# Altium schematic sheet Pretty Fly ngl 2.0.SchDoc
size A3; SheetNumber: 1; SheetTotal: 1
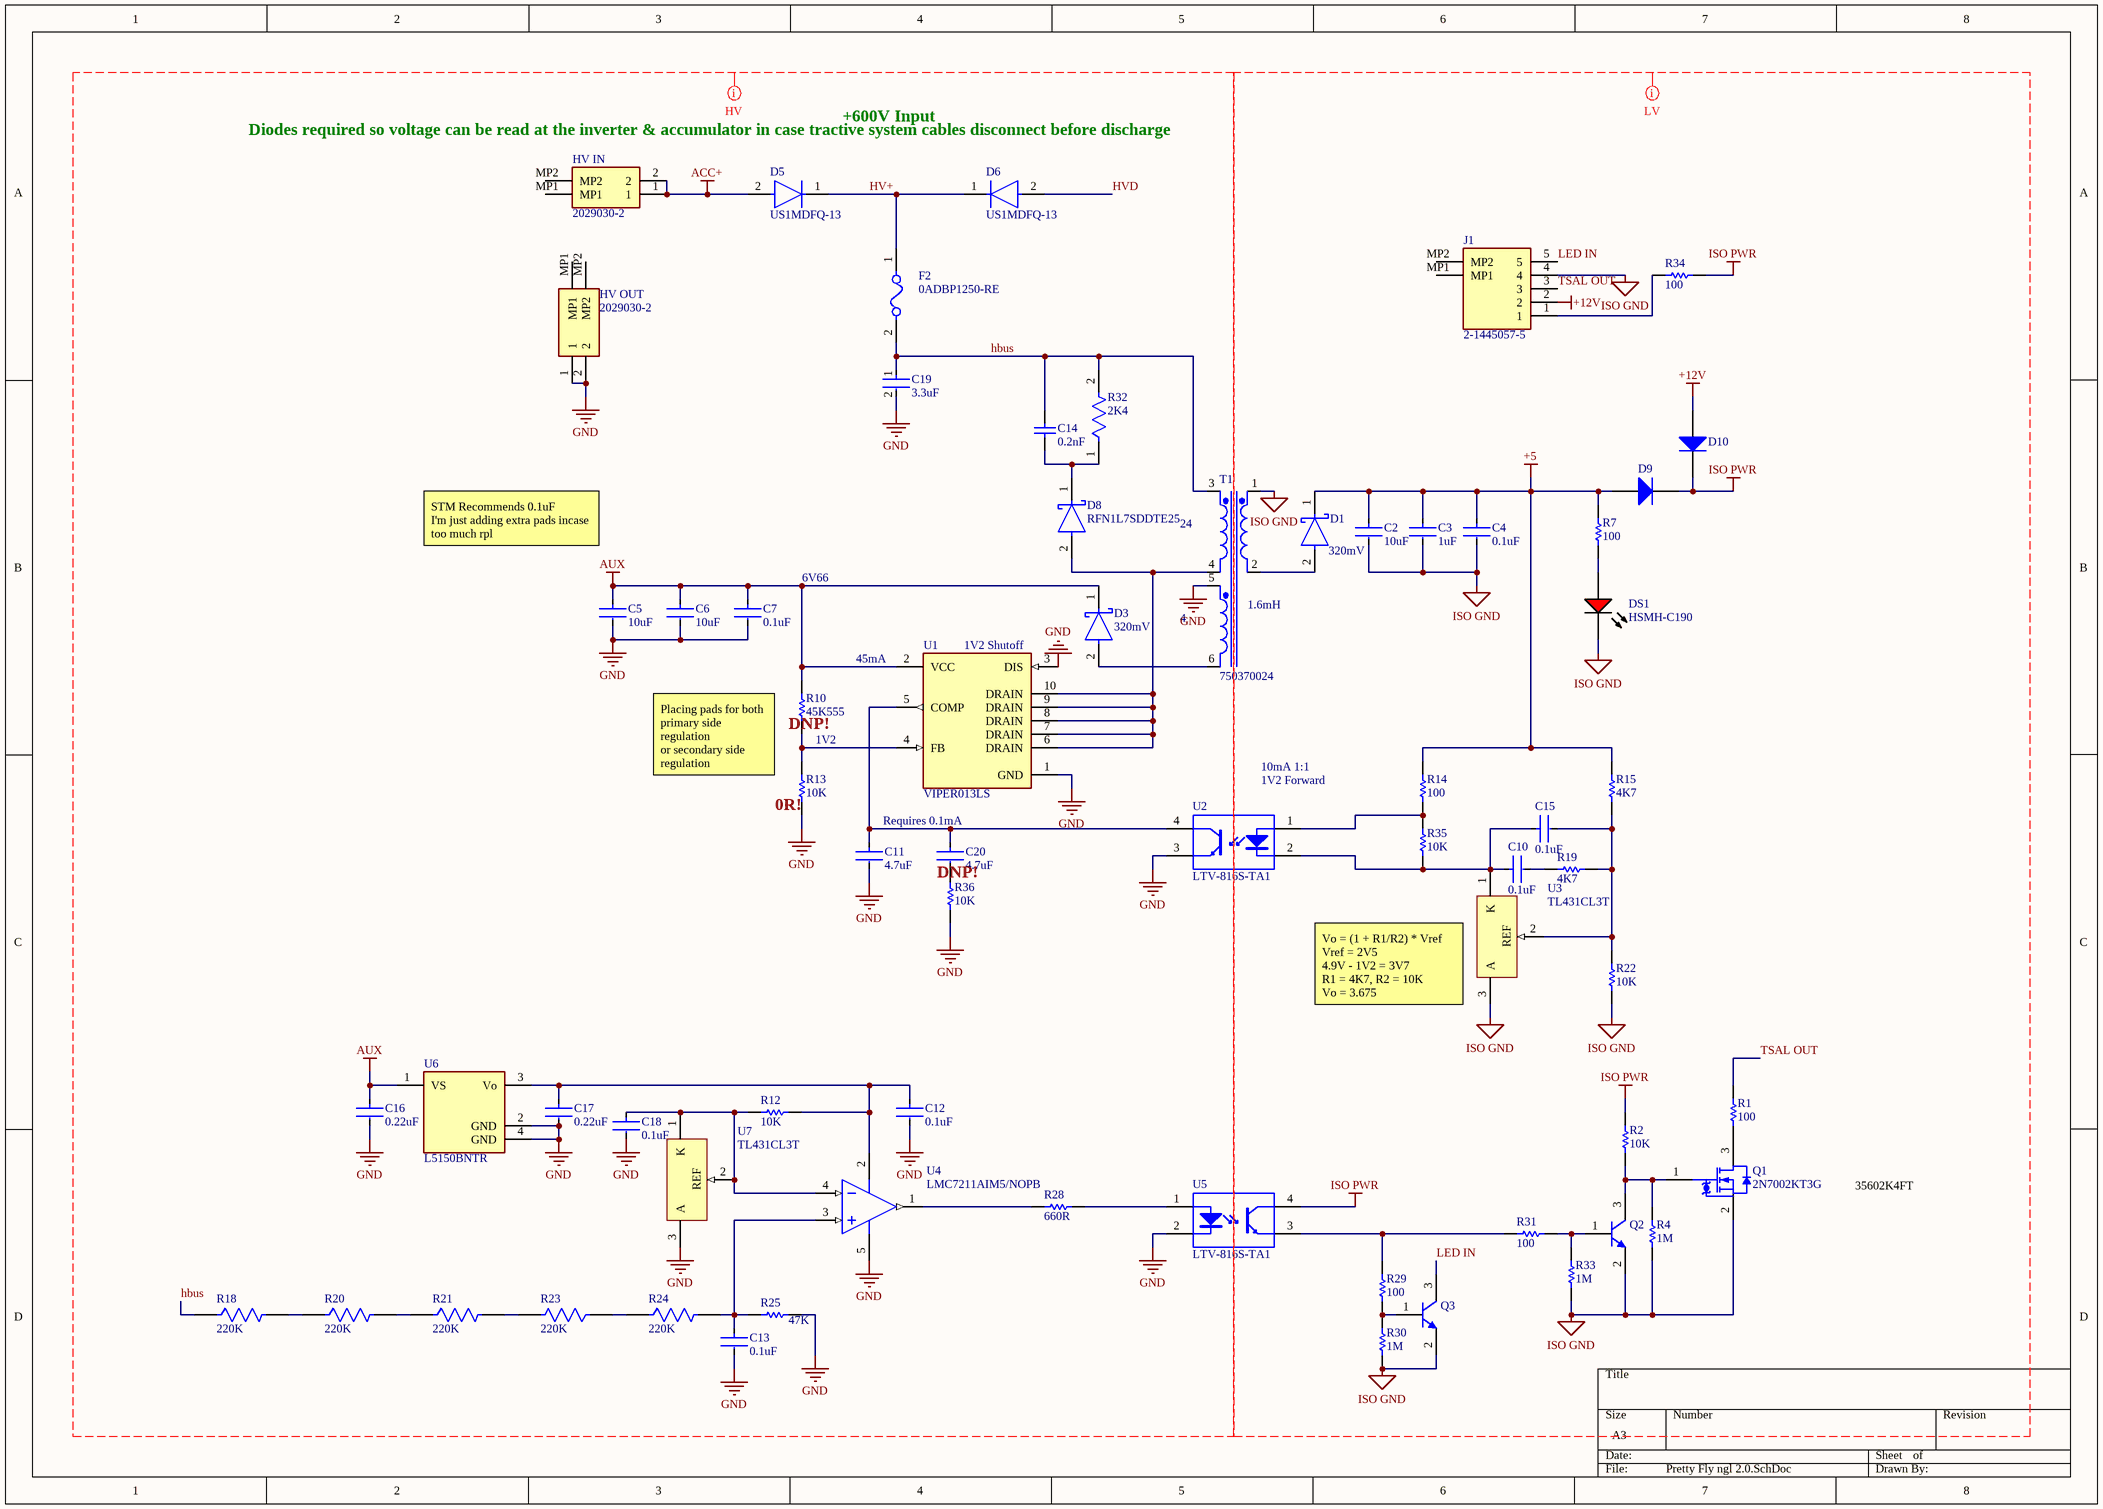
[diagram p0: Pretty Fly ngl 2.0.SchDoc]

## Parts
C2  10uF  [FP-C2012-125-0_2-IPC_B]
C3  1uF  [FP-C2012-125-0_2-IPC_B]
C4  0.1uF  [FP-C2012-125-0_2-IPC_B]
C5  10uF  [FP-C2012-125-0_2-IPC_B]
C6  10uF  [FP-C2012-125-0_2-IPC_B]
C7  0.1uF  [FP-C2012-125-0_2-IPC_B]
C10  0.1uF  [FP-C2012-125-0_2-IPC_B]
C11  4.7uF  [FP-C2012-125-0_2-IPC_B]
C12  0.1uF  [FP-C2012-125-0_2-IPC_B]
C13  0.1uF  [FP-C2012-125-0_2-IPC_B]
C14  0.2nF  [KEMT-1206-2_M]
C15  0.1uF  [FP-C2012-125-0_2-IPC_B]
C16  0.22uF  [FP-C2012-125-0_2-IPC_B]
C17  0.22uF  [FP-C2012-125-0_2-IPC_B]
C18  0.1uF  [FP-C2012-125-0_2-IPC_B]
C19  3.3uF  [FP-ECW-FG1B205JA-MFG]
C20  4.7uF  [FP-C2012-125-0_2-IPC_B]
D1  320mV  [FP-SOD128-MFG]
D3  320mV  [FP-SOD128-MFG]
D5  US1MDFQ-13  [FP-D-FLAT-MFG]
D6  US1MDFQ-13  [FP-D-FLAT-MFG]
D8  RFN1L7SDDTE25  [FP-PMDS-MFG]
D9  PMEG4010EGWX  [SOD-123]  (value not drawn)
D10  PMEG4010EGWX  [SOD-123]  (value not drawn)
DS1  HSMH-C190  [AVAG-HSMX-C190_V]
F2  0ADBP1250-RE  [FP-0ADBP-MFG]
HV_IN  2029030-2  [20290302]
HV_OUT  2029030-2  [20290302]
J1  2-1445057-5  [214450575]
Q1  2N7002KT3G  [ONSC-SOT-23-3-318-08_V]
Q2  MMBTA42LT1G  [ONSC-SOT-23-3-318-08_V]  (value not drawn)
Q3  MMBTA42LT1G  [ONSC-SOT-23-3-318-08_V]  (value not drawn)
R1  100  [RESC1608X55X25ML10T15]
R2  10K  [RESC1608X55X25ML10T15]
R4  1M  [RESC1608X55X25ML10T15]
R7  100  [RESC1608X55X25ML10T15]
R10  45K555  [RESC1608X55X25ML10T15]
R12  10K  [RESC1608X55X25ML10T15]
R13  10K  [RESC1608X55X25ML10T15]
R14  100  [RESC1608X55X25ML10T15]
R15  4K7  [RESC1608X55X25ML10T15]
R18  220K  [FP-CRCW1206-e3-MFG]
R19  4K7  [RESC1608X55X25ML10T15]
R20  220K  [FP-CRCW1206-e3-MFG]
R21  220K  [FP-CRCW1206-e3-MFG]
R22  10K  [RESC1608X55X25ML10T15]
R23  220K  [FP-CRCW1206-e3-MFG]
R24  220K  [FP-CRCW1206-e3-MFG]
R25  47K  [RESC1608X55X25ML10T15]
R28  660R  [RESC1608X55X25ML10T15]
R29  100  [RESC1608X55X25ML10T15]
R30  1M  [RESC1608X55X25ML10T15]
R31  100  [RESC1608X55X25ML10T15]
R32  2K4  [FP-WSR-MFG]
R33  1M  [RESC1608X55X25ML10T15]
R34  100  [RESC1608X55X25ML10T15]
R35  10K  [RESC1608X55X25ML10T15]
R36  10K  [RESC1608X55X25ML10T15]
T1  750370024  [Transformer Viper]
U1  VIPER013LS  [FP-SSOP10-8140761-MFG]
U2  LTV-816S-TA1  [LTST-LTV-816S_V]
U3  TL431CL3T  [SOT23-3_L]
U4  LMC7211AIM5/NOPB  [DBV0005A_M]
U5  LTV-816S-TA1  [LTST-LTV-816S_V]
U6  L5150BNTR  [FP-SOT-223-GAPGPS01378-MFG]
U7  TL431CL3T  [SOT23-3_L]

## Nets
+5: C2.1 C3.1 C4.1 D1.1(K) D9.1(A) R7.2 R14.2 R15.2
+12V: D10.1(A) J1.2
ACC+: D5.2(A) HV_IN.1 HV_IN.2
AUX: C5.1 C6.1 C7.1 C16.1 D3.1(K) R10.2 U1.2(VCC) U6.1(VS)
GND: C5.2 C6.2 C7.2 C11.2 C12.2 C13.2 C16.2 C17.2 C18.2 C19.2 HV_OUT.1 HV_OUT.2 R13.1 R25.1 R36.1 T1.5(Sec2+) U1.1(GND) U1.3(DIS) U2.3(EMITTER) U4.5(V-) U5.2(CATHODE) U6.2(GND) U6.4(GND) U7.3(A)
ISO GND: C2.2 C3.2 C4.2 DS1.2(K) J1.4 Q1.2(S) Q2.2(E) Q3.2(E) R4.1 R22.1 R30.1 R33.1 T1.1(Pri+) U3.3(A)
ISO PWR: D9.2(K) D10.2(K) R2.2 R34.1 U5.4(COLLECTOR)
hbus: C14.2 C19.1 F2.2 R18.1 R32.2 T1.3(Sec1+)
HV+: D5.1(C) D6.1(C) F2.1
HVD: D6.2(A)
LED IN: J1.5 Q3.3(C)
TSAL OUT: J1.3 R1.2
NetC10_1: C10.1 C15.1 R35.1 U2.2(CATHODE) U3.1(K)
NetC10_2: C10.2 R19.1
NetC11_1: C11.1 C20.1 U1.5(COMP) U2.4(COLLECTOR)
NetC12_1: C12.1 C17.1 R12.2 U4.2(V+) U6.3(Vo)
NetC13_1: C13.1 R24.2 R25.2 U4.3(IN+)
NetC14_1: C14.1 D8.1(C) R32.1
NetC15_2: C15.2 R15.1 R19.2 R22.2 U3.2(REF)
NetC18_1: C18.1 R12.1 U4.4(IN-) U7.1(K) U7.2(REF)
NetC20_2: C20.2 R36.2
NetD1_2: D1.2(A) T1.2(Pri-)
NetD3_2: D3.2(A) T1.6(Sec2-)
NetD8_2: D8.2(A) T1.4(Sec1-) U1.6(DRAIN) U1.7(DRAIN) U1.8(DRAIN) U1.9(DRAIN) U1.10(DRAIN)
NetDS1_1: DS1.1(A) R7.1
NetJ1_1: J1.1 R34.2
NetQ1_1: Q1.1(G) Q2.3(C) R2.1 R4.2
NetQ1_3: Q1.3(D) R1.1
NetQ2_1: Q2.1(B) R31.1 R33.2
NetQ3_1: Q3.1(B) R29.1 R30.2
NetR10_1: R10.1 R13.2 U1.4(FB)
NetR14_1: R14.1 R35.2 U2.1(ANODE)
NetR18_2: R18.2 R20.1
NetR20_2: R20.2 R21.1
NetR21_2: R21.2 R23.2
NetR23_1: R23.1 R24.1
NetR28_1: R28.1 U5.1(ANODE)
NetR28_2: R28.2 U4.1(OUT)
NetR29_2: R29.2 R31.2 U5.3(EMITTER)

Not connected (* = marked no-connect by the designer): HV_IN MP1 MP2; HV_OUT MP1 MP2; J1 MP1 MP2

## Layout directives
mark named HV: ACC+, AUX, GND, hbus, HV+, HVD
mark named LV: +5, +12V, ISO GND, ISO PWR, LED IN, TSAL OUT

## Notes on the sheet
- Diodes required so voltage can be read at the inverter & accumulator in case tractive system cables disconnect before discharge
- +600V Input
- STM Recommends 0.1uF
  I'm just adding extra pads incase too much rpl
- 6V66
- (near T1) 24
- (near U1) 1V2 Shutoff
- (near T1) 4
- (near T1) 1.6mH
- 45mA
- Placing pads for both
  primary side regulation
  or secondary side regulation
- (near R10) DNP!
- 1V2
- (near U2) 1V2 Forward
- 10mA 1:1
- (near R13) 0R!
- Requires 0.1mA
- DNP!
- (near U3) Vo = (1 + R1/R2) * Vref
  Vref = 2V5
  4.9V - 1V2 = 3V7
  R1 = 4K7, R2 = 10K
  Vo = 3.675
- 35602K4FT

## Library data of the parts
C2-C7 C10 C12 C13 C15-C18 = CMP-08246-000007-2: Multilayer Ceramic Capacitors 4.7μF ±10% 50V X5R SMD 0805; Capacitance: 4.7uF; Case Code (Metric): 2012; Weight: 0.000194oz; Voltage Rating: 50V; Voltage: 50V; Construction: Flat; Series: C; Packaging: Tape and Reel; Height: 1.25mm; Depth: 1.25mm; Resistor Type: Ceramic; Width: 0.049inch; Length: 2mm; Thickness: 0.057inch; REACH SVHC: No SVHC; Max Operating Temperature: 85°C; Case/Package: 0805; Dielectric: X5R; Tolerance: 10%; Dielectric Material: Ceramic; Package Quantity: 1; Mount: Surface Mount; Radiation Hardening: No; Voltage Rating (DC): 50V; Case Code (Imperial): 0805; Termination: SMD/SMT; Min Operating Temperature: -55°C; Lead Free: Lead Free
C11 C20 = CMP-08246-000007-2: Multilayer Ceramic Capacitors 4.7μF ±10% 50V X5R SMD 0805; Case Code (Metric): 2012; Weight: 0.000194oz; Voltage Rating: 50V; Voltage: 50V; Construction: Flat; Series: C; Packaging: Tape and Reel; Height: 1.25mm; Depth: 1.25mm; Resistor Type: Ceramic; Width: 0.049inch; Length: 2mm; Thickness: 0.057inch; REACH SVHC: No SVHC; Max Operating Temperature: 85°C; Case/Package: 0805; Capacitance: 4.7uF; Dielectric: X5R; Tolerance: 10%; Dielectric Material: Ceramic; Package Quantity: 1; Mount: Surface Mount; Radiation Hardening: No; Voltage Rating (DC): 50V; Case Code (Imperial): 0805; Termination: SMD/SMT; Min Operating Temperature: -55°C; Lead Free: Lead Free
C14 = CMP-1037-04202-2: C3216C0G2J221J060AA; Manufacturer: Kemet; Voltage Rating: 50V; Capacitance: 0.1µF; Product Range: KEMET-CSeries; SVHC: ToBeAdvised; Capacitance Tolerance: ±10%; Dielectric Characteristic: X7R; Capacitor Case Style: 1206[3216Metric]; Package Reference: 1206-2; Package Description: 2-Leads SMD, Body 3.2 x 1.6 mm; Packaging: Tape&Reel; Operating Temperature Max: 125degC; Datasheet URL: https://datasheet.ciiva.com/6125/1725438-6125494.pdf; Manufacturer URL: http://www.kemet.com/; Operating Temperature Min: -55degC; Datasheet Version: Jul-13
C19 = CMP-05434-000001-1: ECW-FG80335J; Manufacturer: Panasonic; Manufacturer Part Number: ECW-FG1B205JA; Material: Metallized Polypropylene; Value: 2uF; Automotive Grade: Grade 2; Voltage Rating: 1100V; Tolerance: 5%; Category: Cap; Octopart: https://octopart.com/ecwfg1b205ja-panasonic-104895355; Digikey Description: CAP FILM 2UF 5% 1.1KVDC RADIAL; Height: 25mm; Temperature Range High: +110°C; Device Class L2: Capacitors; Temperature: -40°C to +110°C; Package: 0; Lead Free: Yes; Temperature Range Low: -40°C; Automotive: Yes; Device Class L3: Film Capacitors; RoHS: TRUE; ComponentLink2URL: https://industrial.panasonic.com/cdbs/www-data/pdf/RDL0000/RDL0000C245.pdf; Device Class L1: Passive Components; Capacitance: 2uF; ComponentLink2Description: Datasheet
D1 D3 = CMP-14398-000034-1: PMEG6030EVPX; RoHS Compliant: Yes
D5 D6 = CMP-12791-000003-1: DIODE GEN PURP 1KV 1A DFLAT; Manufacturer: Diodes; Max Repetitive Reverse Voltage: 1000V; Max Surge Forward Current: 30A; Capacitance: 10pF; Peak Reverse Current: 5uA; Max Junction Temp: +150°C; Automotive Grade: Grade 0; Value: 10pF; Digikey Description: DIODE GEN PURP 1KV 1A DFLAT; Octopart: https://octopart.com/us1mdfq-13-diodes+inc.-75381839; Temperature Range High: +150°C; ComponentLink2Description: Datasheet; Category: Diode; Automotive: Yes; Temperature: -55°C to +150°C; ComponentLink2URL: https://www.diodes.com/assets/Datasheets/US1JDFQ_US1MDFQ.pdf; Package: D-FLAT; Manufacturer Part Number: US1MDFQ-13; Reverse Voltage: 1000V; Device Class L3: Rectifier Diodes; Forward Current: 1A; Height: 1.1mm; Footprint Url: https://www.diodes.com/assets/Package-Files/D-FLAT.pdf; Device Class L2: Diodes; Lead Free: Yes; Device Class L1: Discrete Semiconductors; Temperature Range Low: -55°C; RoHS: TRUE
D8 = CMP-08971-000006-1: Rectifiers DIODE GEN PURPOSE / 45ns / 1.15V; Manufacturer: Rohm; Obsolete Part: true; Manufacturer Part Number: RSX501L-20TE25; Max Repetitive Reverse Voltage: 25V; Max Surge Forward Current: 70A; Peak Reverse Current: 500uA; Forward Current: 5A; Max Junction Temp: +125°C; Reverse Voltage: 20V; Temperature Range High: +125°C; Digikey Description: DIODE SCHOTTKY 20V 5A PMDS; Automotive: No; Height: 2.2mm; Category: Diode; Device Class L3: Schottky Diodes; Octopart: https://octopart.com/rsx501l-20te25-rohm-333183; Temperature: to +125°C; RoHS: TRUE; ComponentLink2URL: https://eu.mouser.com/datasheet/2/348/rsx501l-20te25-e-1139044.pdf; Device Class L2: Diodes; Package: PMDS; Lead Free: Yes; Device Class L1: Discrete Semiconductors; ComponentLink2Description: Datasheet
D9 D10 = 1N4448: 153-0632; Published: 8-Jun-2000; LatestRevisionDate: 17-Jul-2002; LatestRevisionNote: Re-released for DXP Platform.; DatasheetDocument: 1997; PackageReference: DO-35; Publisher: Altium Limited; Code_JEDEC: DO-204-AH; ComponentLink1Description: Manufacturer Link; ComponentLink1URL: http://www.fairchildsemi.com/; ComponentLink2Description: Datasheet; ComponentLink2URL: http://www.fairchildsemi.com/ds/1N%2F1N4448.pdf
DS1 = CMP-1744-00004-1: LED Uni-Color Red, 65 mW, 20 mA, -40 to 85 degC, 2-Pin SMD, RoHS, Tape and Reel; Connector Type: USB; Gender: Male; Current Rating: 1 A; Length: 7.5 mm; Lead Pitch: 0.65 mm; PackageReference: HSMX-C190; Package Quantity: 2000; Max Operating Temperature: 85 degC; PackageDescription: 2-Pin Surface Mount Device, Body 1.6 x 0.8 mm, Height 0.9 mm; ComponentLink3Description: Package Specification; Mount: Surface Mount; Min Operating Temperature: -30 degC; ComponentLink3URL: http://www.fairchildsemi.com/dwg/MA/MA03D.pdf; ComponentLink1Description: Manufacturer URL; Contact Material: Copper; Pins: 5; Width: 5.6 mm; ComponentLink2Description: Datasheet; RoHSCompliant: true; DatasheetVersion: Mar-12; Height: 2.8 mm; Packaging: Tape and Reel; Contact Plating: Gold; ComponentLink1URL: http://www.avagotech.com/; REACH SVHC: No SVHC; ComponentLink2URL: http://docs.avagotech.com/docs/AV02-0551EN
F2 = CMP-16042-000001-1: FUSE CERM 1.25A 1000V AXL; Manufacturer: Bel Fuse; Fuse I2T: 3A2Sec; Fuse Voltage Drop: 550mV; Fuse Blow Speed: Fast; Resistance: 300mΩ; Value: 300mΩ; Ipc Land Pattern Name: CAPAD3723W100L3361D676; Lead Free: Yes; Max Fuse Dc Voltage: 1000V; Device Class L1: Circuit Protection; Manufacturer Part Number: 0ADBP1250-RE; Height: 6.76mm; Package: 0ADBP; Fuse Current: 1.25A; Octopart: https://octopart.com/0adbp1250-re-bel+fuse-88207834; Temperature Range High: +105°C; Device Class L3: unset; Device Class L2: Fuses; Category: Fuse; ComponentLink2URL: https://belfuse.com/resources/datasheets/circuitprotection/ds-cp-0adbx-series.pdf; Temperature: -50°C to +105°C; Voltage Rating: 1000V; Digikey Description: FUSE CERM 1.25A 1000V AXL; Temperature Range Low: -50°C; Max Fuse Ac Voltage: 1000V; ComponentLink2Description: Datasheet; Automotive: No; RoHS: TRUE
HV_IN HV_OUT = 2029030-2: Connector; Manufacturer_Name: TE Connectivity; Datasheet Link: https://datasheet.datasheetarchive.com/originals/distributors/Datasheets_SAMA/f75355dc101dbac16187fb02437cb13d.pdf; Height: 4.37mm; Manufacturer_Part_Number: 2029030-2
J1 = 2-1445057-5: Connector; Manufacturer_Name: TE Connectivity; Datasheet Link: https://componentsearchengine.com/Datasheets/1/2-1445057-5.pdf; Height: 5.67mm; Manufacturer_Part_Number: 2-1445057-5
Q1 = CMP-1058-00785-1: Small Signal MOSFET, 60 V, 380 mA, Single, N-Channel, 3-Pin SOT-23, Pb-Free, Tape and Reel; Manufacturer: On Semiconductor; Crss Typ (pF): 2.2; Ciss Typ (pF): 24.5; VGS Max (V): 20; ID Max (A): 0.38; VGS(th) Max (V): 2.3; Channel Polarity: N Channel; Coss Typ (pF): 4.2; V(BR)DSS Min (V): 60; Package Type: SOT-23-3; Mounting Technology: Surface Mount; ComponentLink2URL: http://www.onsemi.com/pub_link/Collateral/2N7002K-D.PDF; ComponentLink3Description: Package Specification; DatasheetVersion: Rev. 11; Configuration: Single; PackageReference: SOT-23-3-318-08; Packing: Tape and Reel; ComponentLink2Description: Datasheet; PackageVersion: Rev. AP, 11/2009; RoHS: Pb-Free; ComponentLink1Description: Manufacturer URL; ComponentLink1URL: http://www.onsemi.com/; PackageDescription: 3-Pin Small Outline Transistor, Body 2.92 x 1.3 mm, Pitch 0.95 mm; PartNumber: 2N7002KT3G; ComponentLink3URL: http://www.onsemi.cn/pub_link/Collateral/318-08.PDF
Q2 Q3 = CMP-1048-00662-1: High Voltage Transistor, NPN Silicon, 3-Pin SOT-23, Pb-Free, Tape and Reel; Manufacturer: On Semiconductor; fT Min (MHz): 50; IC Continuous (A): 0.5; ComponentLink1URL: http://www.onsemi.com/; ComponentLink3URL: http://www.onsemi.cn/pub_link/Collateral/318-08.PDF; RoHS: TRUE; ComponentLink2Description: Datasheet; PartNumber: MMBTA42LT1G; Polarity: NPN; DatasheetVersion: Rev. 12; PackageReference: SOT-23-3-318-08; PackageDescription: 3-Pin Small Outline Transistor, Body 2.92 x 1.3 mm, Pitch 0.95 mm; ComponentLink3Description: Package Specification; ComponentLink1Description: Manufacturer URL; Packing: Tape and Reel; PackageVersion: Rev. AP, 11/2009; Mounting Technology: Surface Mount; ComponentLink2URL: http://www.onsemi.cn/pub_link/Collateral/MMBTA42LT1-D.PDF
R1 R2 R4 R7 R10 R12-R15 R19 R22 R25 R28-R31 R33-R36 = CMP-2100-03667-1: Chip Resistor, 0 Ohm, +/- 5%, 0.1 W, -55 to 155 degC, 0603 (1608 Metric), RoHS, Tape and Reel; Manufacturer: Yageo; Temperature Coefficient: 200ppm/degreesC; Voltage Rating: 50V; Power Rating: 100mW; Resistance: 0mOhm; Width: 0.8mm; Max Operating Temperature: 155degC; Tolerance: 5%; Package Reference: 0603; Height: 0.45mm; Depth: 0.8mm; Package Description: 2-Pin Surface Mount Device, Body 1.6 x 0.8 mm; Termination: SMD/SMT; Package Quantity: 5000; Case/Package: 0603; Case Code (Imperial): 0603; Radiation Hardening: No; Number of Pins: 2; Length: 1.6mm; Lead Free: LeadFree; Voltage Rating (DC): 50V; Military Standard: Not; Datasheet URL: http://www.yageo.com/NewPortal/yageodocoutput?fileName=/pdf/R-Chip/PYu-RC_Group_51_RoHS_L_5.pdf; Manufacturer URL: http://www.yageo.com/; Packaging: TapeandReel; Case Code (Metric): 1608; Min Operating Temperature: -55degC; Composition: ThickFilm; RoHSCompliant: true; Contact Plating: Tin; Datasheet Version: Rev. 5, 10/2016; REACH SVHC: NoSVHC
R18 R20 R21 R23 R24 = CMP-02407-001891-1: CRMA1206AF220KDKEF; Voltage Rating (DC): 200V; Power Rating: 250mW; Resistance: 33R; Tolerance: 1%; Temperature Coefficient: 100ppm/°C; Features: Automotive AEC-Q200; Case Code (Imperial): 1206; Packaging: Tape and Reel; Package Quantity: 10; Composition: Thick Film; Height: 0.55mm; Depth: 1.6mm; Radiation Hardening: No; Lead Free: Lead Free; Width: 1.6mm; Weight: 0.000353oz; Case Code (Metric): 3216; Max Power Dissipation: 250mW; Voltage Rating: 200V; Termination: SMD/SMT; Min Operating Temperature: -55°C; Case/Package: 1206; Contact Plating: Tin; Max Operating Temperature: 155°C; Military Standard: Not; Number of Terminations: 2; Length: 3.2mm
R32 = CMP-02407-000027-1: Thick Film Resistors - SMD 3560 2K4 1% / 35602K4FT; Manufacturer Part Number: WSR3R1000FEK; Manufacturer: Vishay; Value: 100mΩ; Temperature Coefficient: 75ppm/°C; Power Rating: 3W; Automotive Grade: Grade 0; Digikey Description: RES 0.1 OHM 1% 3W 4527; Temperature Range High: +275°C; ComponentLink2URL: http://www.vishay.com/docs/30101/wsr.pdf; RoHS: TRUE; Device Class L1: Passive Components; Automotive: Yes; Temperature Range Low: -65°C; Tolerance: 1%; Device Class L3: Chip SMD Resistors; Series: WSR; Temperature: -65°C to +275°C; Resistance: 100mΩ; Device Class L2: Resistors; Octopart: https://octopart.com/wsr3r1000fek-vishay-39709091; Package: WSR; Mouser Description: Res Metal Strip 4527 0.1 Ohm 1% 3W ±75ppm/C Sulfur Resistant Molded J-Lead SMD Automotive Bulk; ComponentLink2Description: Datasheet; Composition: Metal Strip; Category: Res; Lead Free: Yes; Height: 2.537mm
T1 = Trans3: Three-winding Transformer (Non-Ideal); Sim Note: Enter the turns ratios, Core loss resistance, Magnetising Reactance, Leakage Reactances and Resistances referred to the primary side into the parameter fields.; Published: 25-Jan-2001; LatestRevisionDate: 17-Jul-2002; LatestRevisionNote: Re-released for DXP Platform.; PackageReference: TRF_6; Publisher: Altium Limited; PackageDescription: Transformer; 6 Leads
U1 = CMP-12154-000005-1: IC OFFLINE CONV PWM 10SSOP; Manufacturer: STMicroelectronics; Switching Frequency: 60kHz; Max Duty Cycle: 80%; Number Of Outputs: 1; Output Type: Fixed; Max Power Dissipation: 1W; Max Junction Temp: +150°C; Min Supply Voltage: 4.5V; Switching Topology: Buck,Buck-Boost,Flyback; Nominal Supply Current: 0.85mA; Standoff Height: 0.1mm; Max Supply Voltage: 30V; Device Class L1: Integrated Circuits (ICs); Lead Free: Yes; Digikey Description: IC OFFLINE CONV PWM 10SSOP; Category: IC; Temperature: -40°C to +150°C; Package: SSOP10-8140761; Automotive: No; Octopart: https://octopart.com/viper013ls-stmicroelectronics-74146980; Temperature Range High: +150°C; Ipc Land Pattern Name: SOP100P600X175-10; Temperature Range Low: -40°C; ComponentLink2Description: Datasheet; RoHS: TRUE; ComponentLink2URL: https://www.st.com/resource/en/datasheet/viper01.pdf; Height: 1.75mm; Device Class L2: Power Management ICs; Manufacturer Part Number: VIPER013LS; Device Class L3: Voltage Regulators - Switching
U2 U5 = CMP-2000-06631-1: Photocoupler, 50 mA, -30 to 110 degC, 4-Pin SMD, RoHS, Tape and Reel; Manufacturer: Lite-On; No of Channels: 1; CTR-Min: 50%; Output Voltage-Max: 80V; Isolation Voltage-Max: 5000V; Datasheet URL: https://datasheet.ciiva.com/6573/s-110-ltv-816826846m-s-s-ta-s-ta1-s-tpseries-6573993.pdf; Package Description: 4-Pin Surface Mount Device, Body 6.5 x 4.6 mm, Pitch 2.54 mm; Manufacturer URL: http://www.us.liteon.com/; Mounting Technology: SurfaceMount; Package Reference: LTV-816S; Operating Temp-Max: 100°C; Datasheet Version: Rev. F, 04/2010
U3 U7 = CMP-0242-00063-1: Programmable Voltage Reference, 2.5 to 36V, 3-Pin SOT23-3, Tape and Reel; PackageVersion: 2011; PackageDescription: 3-Pin SOT-23 Package 0.95 mm Pitch, 2.4 mm Lead Span; PackageReference: SOT23-3; DatasheetVersion: Oct-2011; ComponentLink2Description: Datasheet; ComponentLink2URL: http://www.st.com/internet/com/TECHNICAL_RESOURCES/TECHNICAL_LITERATURE/DATASHEET/CD00000986.pdf; ComponentLink1Description: Manufacturer URL; ComponentLink1URL: http://www.st.com
U4 = CMP-0055-01212-3: Tiny CMOS Comparator with Rail-to-Rail Input, 5-pin SOT-23, Pb-Free; Manufacturer: Texas Instruments; CompType: Amplifiers; PowerWise: N; PackageTopMarking: C00A*XTT; ComponentLink1Description: Datasheet URL; RoHS: Y; Package Reference: DBV0005A; ComponentLink1URL: http://www.ti.com/general/docs/lit/getliterature.tsp?genericPartNumber=LMC7211-N&fileType=pdf; PackageDescription: Molded SOT-23, .115 x .063 x .040 in Body, 5 Lead, .0375 in Pitch; PinCount: 5
U6 = CMP-12153-000003-1: IC REG LINEAR 5V 150MA SOT223; Manufacturer: STMicroelectronics; Min Supply Voltage: 5.6V; Nominal Supply Current: 50uA; Standoff Height: 0.02mm; Output Type: Fixed; Dropout Voltage: 500mV; Number Of Outputs: 1; Max Supply Voltage: 40V; Automotive Grade: Grade 0; Accuracy Percentage: 2%; Max Junction Temp: +150°C; Automotive: Yes; Mouser Description: LDO Voltage Regulators 5V LDO 500mV Vdp 150mA 5.6V to 40V; RoHS: TRUE; Device Class L3: Voltage Regulators - Linear; Lead Free: Yes; Temperature Range High: +150°C; Temperature Range Low: -40°C; Height: 1.9mm; Ipc Land Pattern Name: SOT230P700X190-4; Output Current: 150mA; Device Class L1: Integrated Circuits (ICs); ComponentLink2Description: Datasheet; Category: IC; Digikey Description: IC REG LINEAR 5V 150MA SOT223; ComponentLink2URL: https://www.st.com/resource/en/datasheet/l5150bn.pdf; Octopart: https://octopart.com/l5150bntr-stmicroelectronics-18186753; Footprint Url: https://www.st.com/content/ccc/resource/technical/document/application_note/45/cc/69/ea/2f/8d/4e/3c/CD00004438.pdf/files/CD00004438.pdf/jcr:content/translations/en.CD00004438.pdf; Temperature: -40°C to +150°C; Package: SOT-223-GAPGPS01378; Output Voltage: 5V; Manufacturer Part Number: L5150BNTR; Device Class L2: Power Management ICs